# EAGLE schematic Temperature Senor Board (EAGLE 9.2.2)
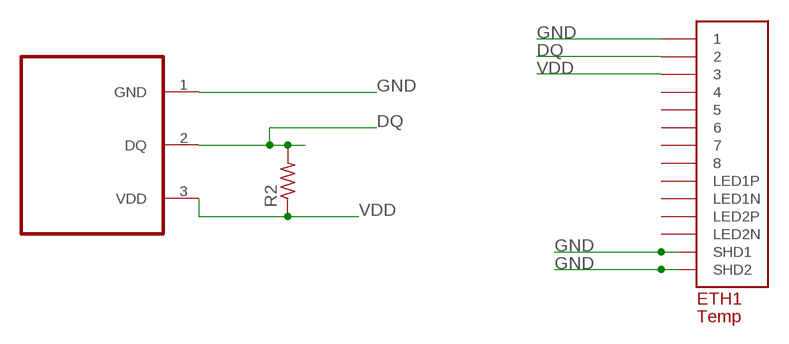
[diagram p0: schematic, sheet 1]

## Parts
ETH1  Temp  ETHERNET  [A122645-ND]
R2  R-US_R0805  [R0805]
U$1  DS18B  [TO92]

## Nets
DQ: ETH1.P$2 R2.2 U$1.2(DQ)
GND: ETH1.P$1 ETH1.P$13(SHD1) ETH1.P$14(SHD2) U$1.1(GND)
VDD: ETH1.P$3 R2.1 U$1.3(VDD)
Unconnected: ETH1.P$4 ETH1.P$5 ETH1.P$6 ETH1.P$7 ETH1.P$8 ETH1.P$9(LED1N) ETH1.P$10(LED1P) ETH1.P$11(LED2N) ETH1.P$12(LED2P)

## Library data of the parts
ETH1 = ETHERNET:ETHERNET: Ethernet port with 2 leds. digikey number A122645-ND
R2 = rcl:R-US_: RESISTOR, American symbol; SPICEPREFIX: R
U$1 = temperatureboardElizabeth:DS18B

## Module TEM
Ports: 

### Library data of the parts